# EAGLE design 30x70-motor-controller-0.4 (EAGLE 7.7.0)

## Sheet 1 of 2
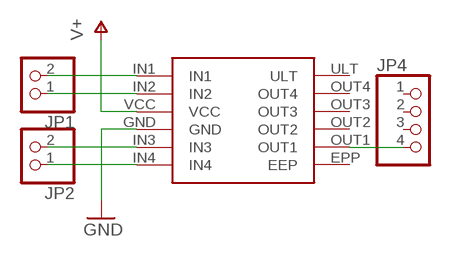
[diagram p0: schematic, sheet 1]

### Parts
JP1  PINHD-1X2/90  [1X02/90]
JP2  PINHD-1X2/90  [1X02/90]
JP4  PINHD-1X4/90  [1X04/90]
U$1  DRV8833-MODULE  [DRV8833-BRKOUT]

### Nets
GND: U$1.GND ; also sheet 2
N$1: JP2.2 U$1.IN3
N$2: JP2.1 U$1.IN4
N$3: JP1.2 U$1.IN1
N$4: JP1.1 U$1.IN2
N$14: JP4.4 U$1.OUT1
V+: U$1.VCC ; also sheet 2
Unconnected: JP4.1 JP4.2 JP4.3 U$1.EPP(EEP) U$1.OUT2 U$1.OUT3 U$1.OUT4 U$1.ULT

## Sheet 2 of 2
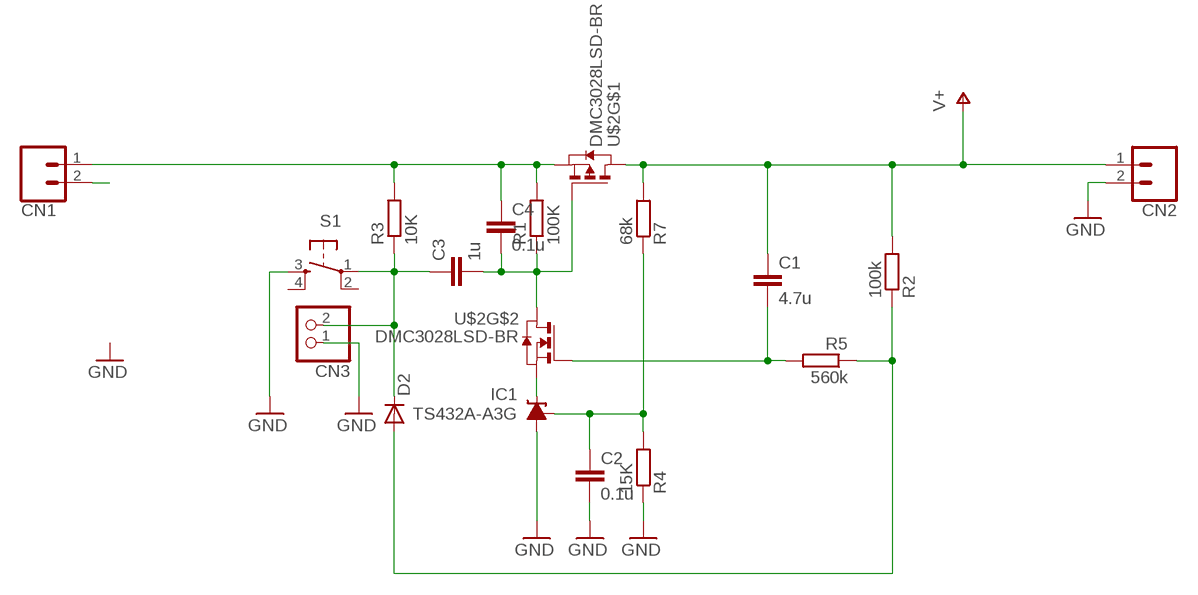
[diagram p1: schematic, sheet 2]

### Parts
C1  4.7u  C-EU025-025X050  [C025-025X050]
C2  0.1u  C-EU025-024X044  [C025-024X044]
C3  1u  C-EU025-024X044  [C025-024X044]
C4  0.1u  C-EU025-024X044  [C025-024X044]
CN1  CONN_02-JST-XTH  [JST-2-XTH]
CN2  CONN_02-JST-XTH  [JST-2-XTH]
CN3  PINHD-1X2/90  [1X02/90]
D2  DIODE-D-2.5  [D-2.5]
IC1  TS432A-A3G  [TO92-LINE]
R1  100K  R-EU_0204/2V  [0204V]
R2  100k  R-EU_0204/2V  [0204V]
R3  10K  R-EU_0204/2V  [0204V]
R4  15K  R-EU_0204/2V  [0204V]
R5  560k  R-EU_0204/7  [0204/7]
R7  68k  R-EU_0204/7  [0204/7]
S1  PROTO-MICRO-SWITCH  [B3F-10XX-PROTO]
U$2  DMC3028LSD-BR  [DIL8-BREAKOUT]

### Nets
GND: C2.2 CN2.2 CN3.1 IC1.2(A) R4.1 S1.3(S) ; also sheet 1
N$5: C4.1 CN1.1 R1.2 R3.2 U$2.3(S)
N$6: C3.2 C4.2 R1.1 U$2.4(G) U$2.7(D) U$2.8(D)
N$7: CN1.2
N$8: C2.1 IC1.3(FB) R4.2 R7.1
N$9: C1.2 R5.2 U$2.2(G)
N$10: D2.A R2.1 R5.1
N$13: IC1.1(C) U$2.1(S)
N$17: C3.1 CN3.2 D2.C R3.1 S1.1(P)
V+: C1.1 CN2.1 R2.2 R7.2 U$2.5(D) U$2.6(D) ; also sheet 1
Unconnected: S1.2(P1) S1.4(S1)

## Library data of the parts
C1-C4 = resistor:C-EU: CAPACITOR, European symbol
CN1 CN2 = assorted:CONN_02: Multi connection point. Often used as Generic Header-pin footprint for 0.1 inch spaced/style header connections On any of the 0.1 inch spaced packages, you can populate with these: Break Away Headers - Straight <https://www.sparkfun.com/products/116> (PRT-00116) Break Away Male Headers - Right Angle <https://www.sparkfun.com/products/553> (PRT-00553) Female Headers <https://www.sparkfun.com/products/115> (PRT-00115) Break Away Headers - Machine Pin <https://www.sparkfun.com/products/117> (PRT-00117) Break Away Female Headers - Swiss Machine Pin <https://www.sparkfun.com/products/743> (PRT-00743) For SCREWTERMINALS and SPRING TERMINALS visit here: Screw Terimnals on SparkFun.com <https://www.sparkfun.com/search/results?term=Screw+Terminals> (5mm/3.5mm/2.54mm spacing) This device is also useful as a general connection point to wire up your design to another part of your project. Our various solder wires solder well into these plated through hole pads. Hook-Up Wire - Assortment (Stranded, 22 AWG) <https://www.sparkfun.com/products/11375> (PRT-11375) Hook-Up Wire - Assortment (Solid Core, 22 AWG) <https://www.sparkfun.com/products/11367> (PRT-11367) View the entire wire category on our website here <https://www.sparkfun.com/categories/141> Special notes: Molex polarized connector foot print use with: PRT-08233 with associated crimp pins and housings. 2.54_SCREWTERM for use with PRT-10571. 3.5mm Screw Terminal footprints for PRT-08084 5mm Screw Terminal footprints for use with PRT-08432
CN3 JP1 JP2 = pinhead:PINHD-1X2: PIN HEADER
D2 = diode:DIODE-: DIODE
IC1 = assorted:TS432A: Shunt regulator 1.24V 1% 0.8uA-100mA 18V
JP4 = pinhead:PINHD-1X4: PIN HEADER
R1-R5 R7 = resistor:R-EU_: RESISTOR, European symbol
S1 = assorted:PROTO-MICRO-SWITCH: OMRON SWITCH
U$1 = assorted:DRV8833-MODULE
U$2 = assorted:DMC3028LSD

## Board
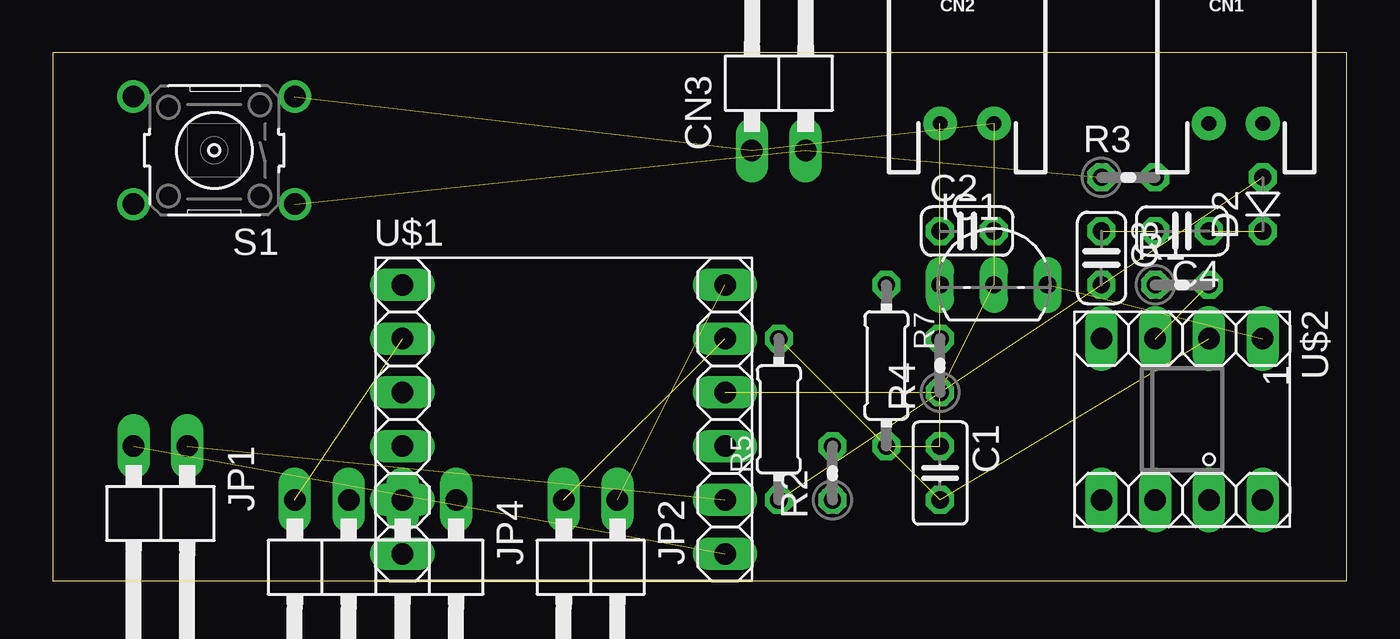
[diagram p2: board, top side]
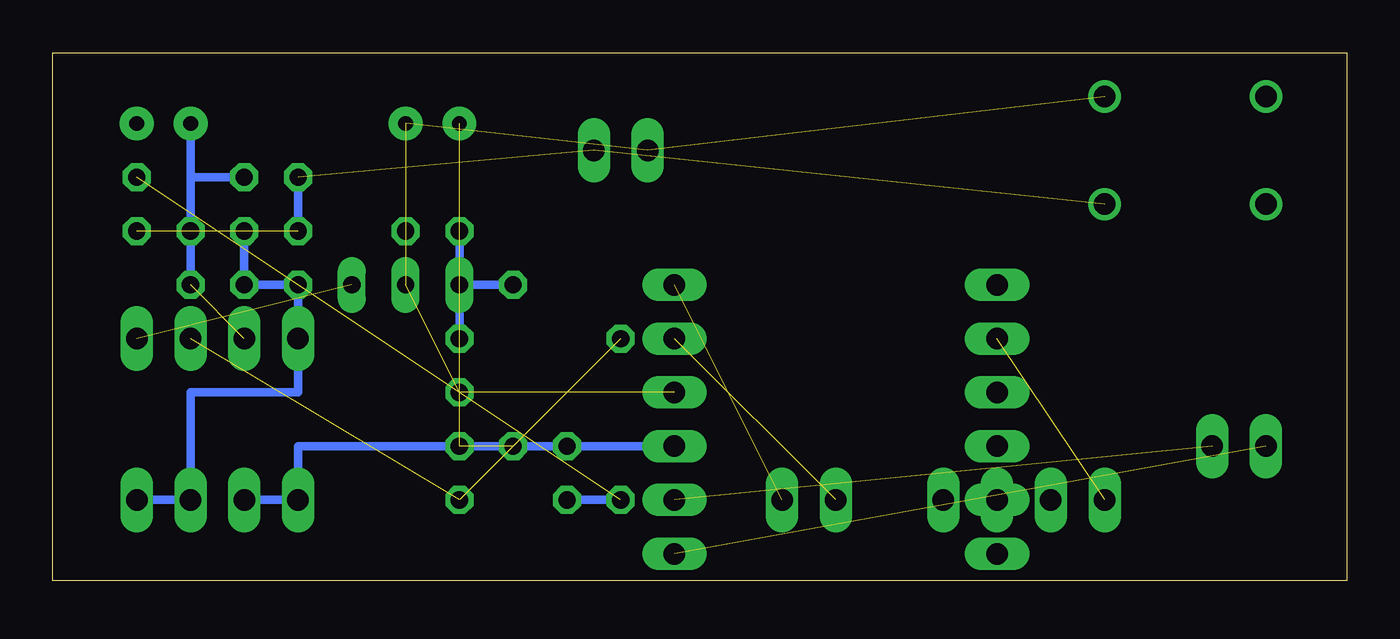
[diagram p3: board, bottom side, seen from below]

Size 61.11 x 24.92 mm. Coordinates in mm from the lower left corner, seen from the top.
Outline: 0,0 61.11,0 61.11,24.92 0,24.92 0,0
Copper layers (1*16): Top 0.035mm / dielectric 1.5mm / Bottom 0.035mm
Design rules "default": minimum track width 10mil, minimum drill 24mil, track to track 8mil, track to pad 8mil, pad to pad 8mil, via to via 8mil, smd to smd 8mil, copper to edge 40mil, drill to drill 8mil, minimum pad ring 10mil, minimum via ring 8mil, stop-mask expansion 4mil, vias tented up to drill 0mil, thermal gap 10mil

### Footprints (pad centres in the part's own frame; a part is rotated, then mirrored left to right if it is on the bottom)
C025-025X050 = drill 0.813 octagon: 1 -1.27,0; 2 1.27,0
C025-024X044 = drill 0.813 octagon: 1 -1.27,0; 2 1.27,0
JST-2-XTH = drill 0.7 pad 1.6: 1 -1.27,0; 2 1.27,0
1X02/90 = drill 1.016 long: 1 -1.27,-3.81; 2 1.27,-3.81
D-2.5 = drill 0.813 octagon: A 1.27,0; C -1.27,0
TO92-LINE = drill 0.813 long: 1 2.54,0; 2 0,0; 3 -2.54,0
1X04/90 = drill 1.016 long: 1 -3.81,-3.81; 2 -1.27,-3.81; 3 1.27,-3.81; 4 3.81,-3.81
0204V = drill 0.813 octagon: 1 -1.27,0; 2 1.27,0
0204/7 = drill 0.813 octagon: 1 -3.81,0; 2 3.81,0
B3F-10XX-PROTO = drill 1.016: 1 -3.81,2.54; 2 3.81,2.54; 3 -3.81,-2.54; 4 3.81,-2.54
DRV8833-BRKOUT = drill 1.016 long: EPP -7.62,6.35; GND 7.62,1.27; IN1 7.62,-6.35; IN2 7.62,-3.81; IN3 7.62,3.81; IN4 7.62,6.35; OUT1 -7.62,3.81; OUT2 -7.62,1.27; OUT3 -7.62,-1.27; OUT4 -7.62,-3.81; ULT -7.62,-6.35; VCC 7.62,-1.27
DIL8-BREAKOUT = drill 1.016 long: 1 -3.81,3.81; 2 -3.81,1.27; 3 -3.81,-1.27; 4 -3.81,-3.81; 5 3.81,-3.81; 6 3.81,-1.27; 7 3.81,1.27; 8 3.81,3.81

### Placement (x,y rotation side)
C1  41.91,5.08 270 top
C2  43.18,16.51 0 top
C3  49.53,15.24 270 top
C4  53.34,16.51 180 top
CN1  55.88,21.59 0 top
CN2  43.18,21.59 0 top
CN3  34.29,24.13 0 top
D2  57.15,17.78 90 top
IC1  44.45,13.97 0 top
JP1  5.08,2.54 180 top
JP2  25.4,0 180 top
JP4  15.24,0 180 top
R1  53.34,13.97 0 top
R2  36.83,5.08 90 top
R3  50.8,19.05 0 top
R4  41.91,10.16 90 top
R5  34.29,7.62 90 top
R7  39.37,10.16 270 top
S1  7.62,20.32 180 top
U$1  24.13,7.62 0 top
U$2  53.34,7.62 270 top

### Tracks (layer width: path | path; a pad name or v marks a point on that pad's centre or on a via)
GND  (6 unrouted)
N$1  (1 unrouted)
N$2  (1 unrouted)
N$3  (1 unrouted)
N$4  (1 unrouted)
N$5  (1 unrouted)
  Bottom 0.406: R1.2 C4.1 54.61,19.05 | CN1.1 54.61,19.05 | R3.2 54.61,19.05
N$6
  Bottom 0.406: C4.2 R1.1 C3.2 U$2.4 49.53,8.89 54.61,8.89 U$2.7 U$2.8
N$8
  Bottom 0.406: C2.1 IC1.3 | IC1.3 R4.2 | IC1.3 R7.1
N$9  (2 unrouted)
N$10  (1 unrouted)
  Bottom 0.406: R2.1 R5.1
N$13  (1 unrouted)
N$14  (1 unrouted)
N$17  (3 unrouted)
  Bottom 0.406: R3.1 C3.1
V+  (2 unrouted)
  Bottom 0.406: U$1.VCC R2.2 R7.2 49.53,6.35 U$2.5 U$2.6